# Altium schematic sheet XMC4800-Power.SchDoc: XMC4800-Power
size A4
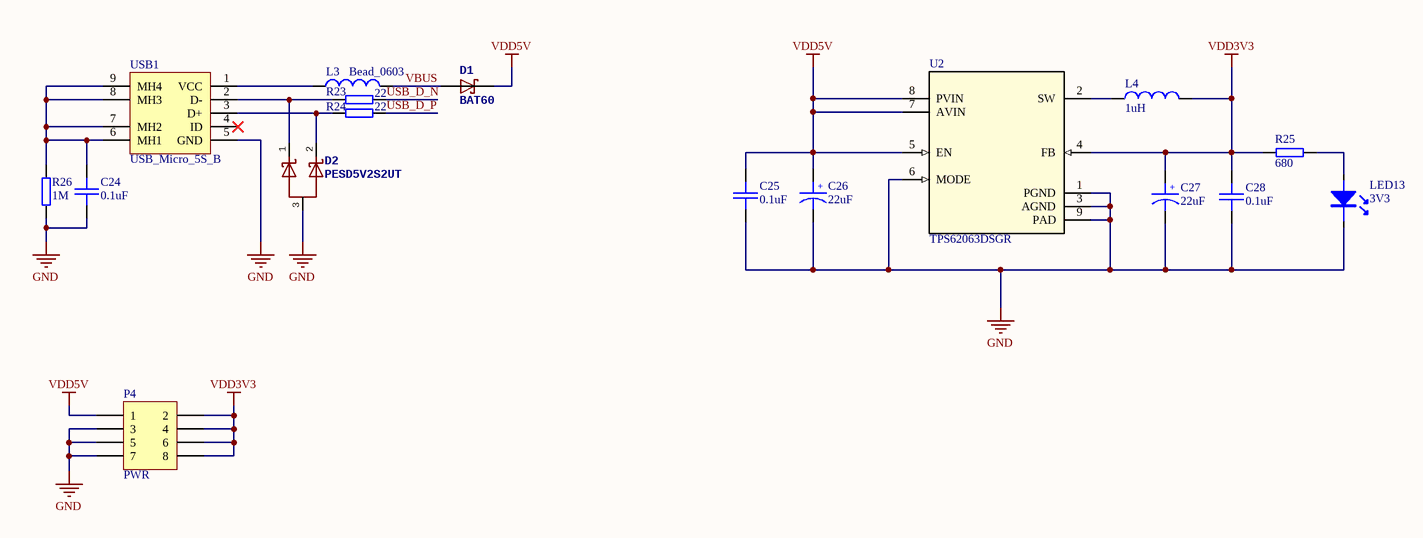
[diagram p0: XMC4800-Power.SchDoc]

## Parts
C24  0.1uF  [CAP-0603]
C25  0.1uF  [CAP-0603]
C26  22uF  [C_Tantalum_B]
C27  22uF  [C_Tantalum_B]
C28  0.1uF  [CAP-0603]
D1  BAT60  [LC-SOD-323]
D2  PESD5V2S2UT  [LC-SOT-23-3]
L3  Bead_0603  [L-0603]
L4  1uH  [L-PWR-06030]
LED13  3V3  [LED_0603]
P4  PWR  [HDR2X4]
R23  22  [RES-0603]
R24  22  [RES-0603]
R25  680  [RES-0603]
R26  1M  [RES-0603]
U2  TPS62063DSGR  [DSG0008A]
USB1  USB_Micro_5S_B  [USB_MICRO_5S_B]

## Nets
GND: C24.2 C25.2 C26.2 C27.2 C28.2 D2.3 LED13.2(K) P4.3 P4.5 P4.7 R26.1 U2.1(PGND) U2.3(AGND) U2.6(MODE) U2.9(PAD) USB1.5(GND)
VDD3V3: C27.1 C28.1 L4.2 P4.2 P4.4 P4.6 P4.8 R25.1 U2.4(FB)
VDD5V: C25.1 C26.1 D1.2(C) P4.1 U2.5(EN) U2.7(AVIN) U2.8(PVIN)
USB_D_N: R23.2
USB_D_P: R24.2
VBUS: D1.1(A) L3.2
NetC24_1: C24.1 R26.2 USB1.6(MH1) USB1.7(MH2) USB1.8(MH3) USB1.9(MH4)
NetD2_1: D2.1 R23.1 USB1.2(D-)
NetD2_2: D2.2 R24.1 USB1.3(D+)
NetL3_1: L3.1 USB1.1(VCC)
NetL4_1: L4.1 U2.2(SW)
NetLED13_1: LED13.1(A) R25.2

Not connected (* = marked no-connect by the designer): USB1 4(ID)*

## Notes on the sheet
- Title
- Size:
- Date:
- A4
- Number:
- Time:
- Revision:
- Sheet
- of
- File:
- (in symbol C_Tantalum_B) +

## Library data of the parts
C24 C25 C28 = C_0603: 陶瓷贴片电容0603; tolerance: 10%; voltage: 50V; ESR: 1.73mOhm; IRMS: 5.59A; C_value: 0.1uF; Series: X7R
C26 C27 = C_Tantalum_B: 贴片钽电容B型; voltage: 16V; C_value: 22uF
D1 = BAT60: 肖特基二极管
L3 = Bead_0603: 贴片磁珠0603; Impedance: 120Ohm; Current: 2A
L4 = L_Power: 功率电感; DCR: 0.1Ohm; IDC: 2.7A; tolerance: 20%; L_value: 1uH
LED13 = LED_0603: 0603封装发光二极管
P4 = Header 4X2: Header, 4-Pin, Dual row; LatestRevisionDate: 17-Jul-2002; LatestRevisionNote: Re-released for DXP Platform.; Publisher: Altium Limited
R23-R26 = R_0603: 贴片电阻0603; tolerance: 5%; voltage: 50V; power: 0.063W
  R23 R24: R_value: 22
  R25: R_value: 680
  R26: R_value: 1M
U2 = TPS62063DSGR: Manufacturer: Texas Instruments; CompType: IC; PIN_COUNT: 9; PartNumber: TPS62063DSG; PackageReference: DSG0008A; MountType: SMT; RoHS: Y; Manufacturer_Part_Number: TPS62063DSGR; Manufacturer_Name: Texas Instruments; Value: Value; Type: Type; Refdes: Refdes
USB1 = USB_Micro_5S_B: micro USB母座5SB型